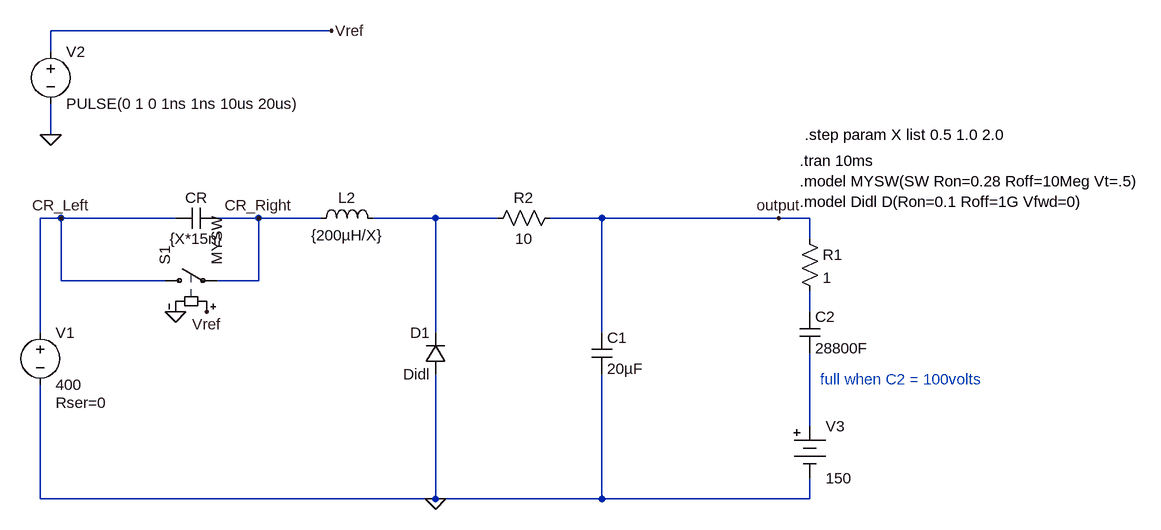
[diagram p0: schematic van-charger.asc]
van-charger.asc, the LTspice schematic file:
Version 4
SHEET 1 1360 680
WIRE 32 -160 -400 -160
WIRE -400 -128 -400 -160
WIRE -400 0 -400 -48
WIRE -384 128 -416 128
WIRE -208 128 -384 128
WIRE -80 128 -144 128
WIRE 16 128 -80 128
WIRE 192 128 96 128
WIRE 288 128 192 128
WIRE 448 128 368 128
WIRE 720 128 448 128
WIRE 768 128 720 128
WIRE 768 160 768 128
WIRE -384 224 -384 128
WIRE -224 224 -384 224
WIRE -80 224 -80 128
WIRE -80 224 -144 224
WIRE 768 272 768 240
WIRE -416 304 -416 128
WIRE 192 304 192 128
WIRE 448 304 448 128
WIRE 768 448 768 336
WIRE -416 560 -416 384
WIRE 192 560 192 368
WIRE 192 560 -416 560
WIRE 448 560 448 368
WIRE 448 560 192 560
WIRE 768 560 768 528
WIRE 768 560 448 560
FLAG 192 560 0
FLAG -400 0 0
FLAG 32 -160 Vref
FLAG -80 128 CR_Right
FLAG -384 128 CR_Left
FLAG -208 272 0
FLAG -160 272 Vref
FLAG 720 128 output
SYMBOL diode 208 368 R180
WINDOW 0 24 64 Left 2
WINDOW 3 24 0 Left 2
SYMATTR InstName D1
SYMATTR Value Didl
SYMBOL cap 432 304 R0
SYMATTR InstName C1
SYMATTR Value 20µF
SYMBOL res 752 144 R0
SYMATTR InstName R1
SYMATTR Value 1
SYMBOL ind 0 144 R270
WINDOW 0 32 56 VTop 2
WINDOW 3 5 56 VBottom 2
SYMATTR InstName L2
SYMATTR Value {200µH/X}
SYMATTR SpiceLine Rser=10
SYMBOL voltage -416 288 R0
WINDOW 123 0 0 Left 2
WINDOW 39 24 124 Left 2
SYMATTR SpiceLine Rser=0
SYMATTR InstName V1
SYMATTR Value 400
SYMBOL cap -144 112 R90
WINDOW 0 0 32 VBottom 2
WINDOW 3 32 32 VTop 2
SYMATTR InstName CR
SYMATTR Value {X*15n}
SYMBOL voltage -400 -144 R0
SYMATTR InstName V2
SYMATTR Value PULSE(0 1 0 1ns 1ns 10us 20us)
SYMBOL sw -240 224 R270
SYMATTR InstName S1
SYMATTR Value MYSW
SYMBOL res 384 112 R90
WINDOW 0 0 56 VBottom 2
WINDOW 3 32 56 VTop 2
SYMATTR InstName R2
SYMATTR Value 10
SYMBOL cap 752 272 R0
SYMATTR InstName C2
SYMATTR Value 28800F
SYMBOL Misc\\battery 768 432 R0
SYMATTR InstName V3
SYMATTR Value 150
TEXT 752 40 Left 2 !.tran 10ms\n.model MYSW(SW Ron=0.28 Roff=10Meg Vt=.5)\n.model Didl D(Ron=0.1 Roff=1G Vfwd=0)
TEXT 760 0 Left 2 !.step param X list 0.5 1.0 2.0
TEXT 784 376 Left 2 ;full when C2 = 100volts

The netlist it stands for:
* van-charger.asc
D1 0 N001 Didl
C1 output 0 20µF
R1 output N002 1
L2 CR_Right N001 {200µH/X} Rser=10
V1 CR_Left 0 400 Rser=0
CR CR_Right CR_Left {X*15n}
V2 Vref 0 PULSE(0 1 0 1ns 1ns 10us 20us)
S1 CR_Left CR_Right Vref 0 MYSW
R2 output N001 10
C2 N002 N003 28800F
V3 N003 0 150
.model D D
.lib standard.dio
.tran 10ms
.model MYSW(SW Ron=0.28 Roff=10Meg Vt=.5)
.model Didl D(Ron=0.1 Roff=1G Vfwd=0)
.step param X list 0.5 1.0 2.0
* full when C2 = 100volts
.backanno
.end